# EAGLE design mini_BGM111 (EAGLE 7.4.0)
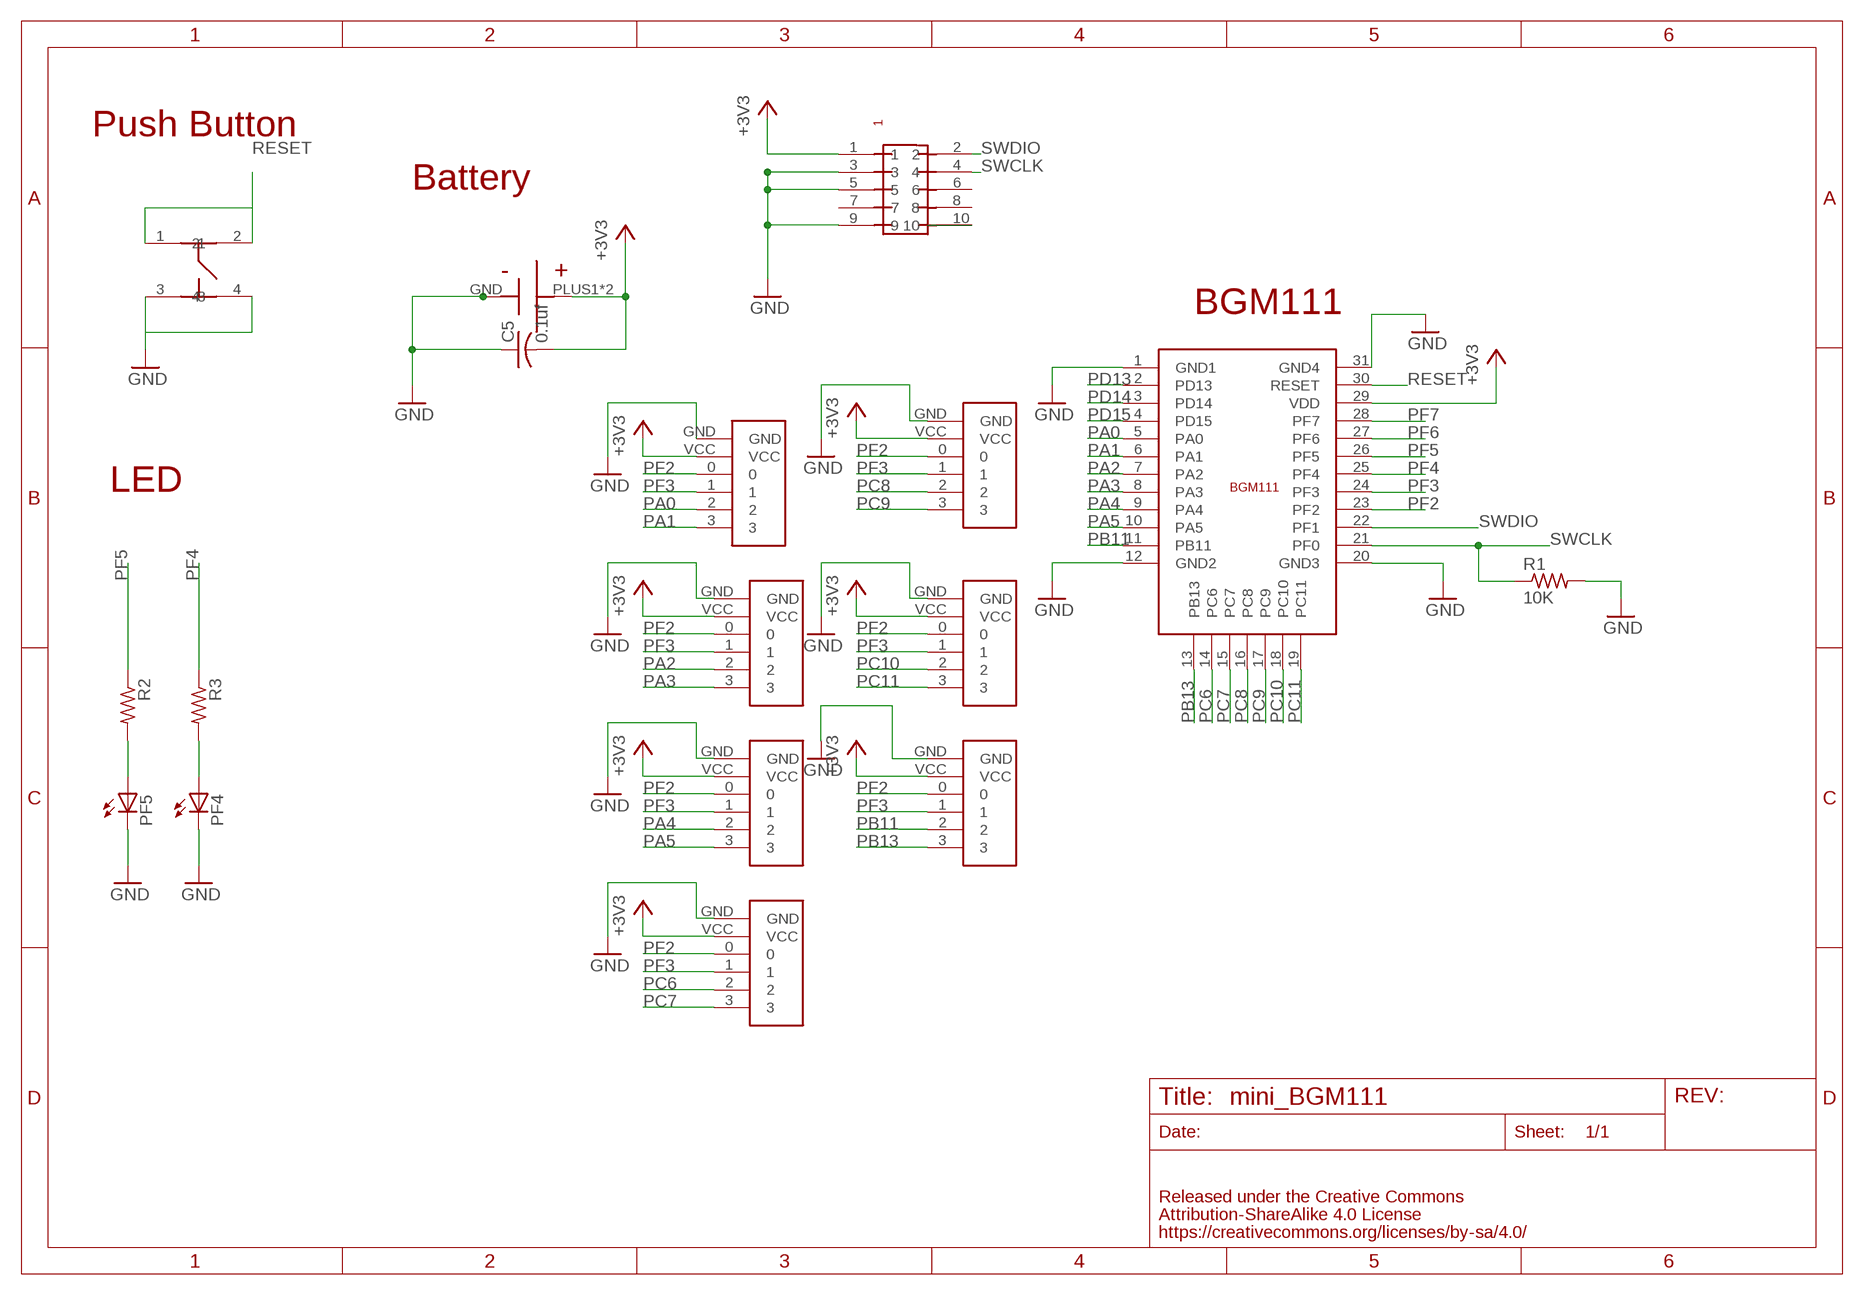
[diagram p0: schematic, sheet 1]

## Parts
C5  0.1uf  C-USC0603  [C0603]
PF4  LEDCHIP-LED0603  [CHIP-LED0603]
PF5  LEDCHIP-LED0603  [CHIP-LED0603]
R1  10K  R-US_R0603  [R0603]
R2  R-US_R0603  [R0603]
R3  R-US_R0603  [R0603]
U$1  SILICONLABS-BGM111  [SILICONLABS-BGM111]
U$2  FABO-PIN-HEADER-2X3-SMD  [FABO-PIN-HEADER-2X3-SMD]
U$3  FABO-PIN-HEADER-2X3-SMD  [FABO-PIN-HEADER-2X3-SMD]
U$4  PIN-HEADER-SMT(1.27MM)2X5  [PIN-HEADER-SMT(1.27MM)2X5]
U$5  SWICTH-4P(KMR2)  [SWITCH-4P(KMR2)]
U$7  FABO-PIN-HEADER-2X3-SMD  [FABO-PIN-HEADER-2X3-SMD]
U$8  FABO-PIN-HEADER-2X3-SMD  [FABO-PIN-HEADER-2X3-SMD]
U$9  FABO-PIN-HEADER-2X3-SMD  [FABO-PIN-HEADER-2X3-SMD]
U$10  FABO-PIN-HEADER-2X3-SMD  [FABO-PIN-HEADER-2X3-SMD]
U$11  FABO-PIN-HEADER-2X3-SMD-BOTTOM  [FABO-PIN-HEADER-2X3-SMD-BOTTOM]
U$12  BRX1-2477  [BRX1-2477]

## Nets
+3V3: C5.2 U$1.29(VDD) U$2.VCC U$3.VCC U$4.1 U$7.VCC U$8.VCC U$9.VCC U$10.VCC U$11.VCC U$12.PLUS1(+) U$12.PLUS2(+)
GND: C5.1 PF4.C PF5.C R1.2 U$1.1(GND1) U$1.12(GND2) U$1.20(GND3) U$1.31(GND4) U$2.GND U$3.GND U$4.3 U$4.5 U$4.9 U$5.3 U$5.4 U$7.GND U$8.GND U$9.GND U$10.GND U$11.GND U$12.GND(-)
N$1: PF5.A R2.2
N$2: PF4.A R3.2
PA0: U$1.5(PA0) U$3.2
PA1: U$1.6(PA1) U$3.3
PA2: U$1.7(PA2) U$7.2
PA3: U$1.8(PA3) U$7.3
PA4: U$1.9(PA4) U$8.2
PA5: U$1.10(PA5) U$8.3
PB11: U$1.11(PB11) U$11.2
PB13: U$1.13(PB13) U$11.3
PC6: U$1.14(PC6) U$2.2
PC7: U$1.15(PC7) U$2.3
PC8: U$1.16(PC8) U$9.2
PC9: U$1.17(PC9) U$9.3
PC10: U$1.18(PC10) U$10.2
PC11: U$1.19(PC11) U$10.3
PD13: U$1.2(PD13)
PD14: U$1.3(PD14)
PD15: U$1.4(PD15)
PF2: U$1.23(PF2) U$2.0 U$3.0 U$7.0 U$8.0 U$9.0 U$10.0 U$11.0
PF3: U$1.24(PF3) U$2.1 U$3.1 U$7.1 U$8.1 U$9.1 U$10.1 U$11.1
PF4: R3.1 U$1.25(PF4)
PF5: R2.1 U$1.26(PF5)
PF6: U$1.27(PF6)
PF7: U$1.28(PF7)
RESET: U$1.30(RESET) U$5.1 U$5.2
RESET1: U$4.10
SWCLK: R1.1 U$1.21(PF0) U$4.4
SWDIO: U$1.22(PF1) U$4.2
Unconnected: U$4.6 U$4.7 U$4.8

## Notes on the sheet
- Push Button
- Battery
- BGM111
- LED

## Library data of the parts
C5 = adafruit:C-US: CAPACITOR, American symbol
PF4 PF5 = led:LED: LED OSRAM: - CHIPLED LG R971, LG N971, LY N971, LG Q971, LY Q971, LO R971, LY R971 LH N974, LH R974 LS Q976, LO Q976, LY Q976 LO Q996 - Hyper CHIPLED LW Q18S LB Q993, LB Q99A, LB R99A - SideLED LS A670, LO A670, LY A670, LG A670, LP A670 LB A673, LV A673, LT A673, LW A673 LH A674 LY A675 LS A676, LA A676, LO A676, LY A676, LW A676 LS A679, LY A679, LG A679 - Hyper Micro SIDELED® LS Y876, LA Y876, LO Y876, LY Y876 LT Y87S - SmartLED LW L88C, LW L88S LB L89C, LB L89S, LG L890 LS L89K, LO L89K, LY L89K LS L896, LA L896, LO L896, LY L896 - TOPLED LS T670, LO T670, LY T670, LG T670, LP T670 LSG T670, LSP T670, LSY T670, LOP T670, LYG T670 LG T671, LOG T671, LSG T671 LB T673, LV T673, LT T673, LW T673 LH T674 LS T676, LA T676, LO T676, LY T676, LB T676, LH T676, LSB T676, LW T676 LB T67C, LV T67C, LT T67C, LS T67K, LO T67K, LY T67K, LW E67C LS E67B, LA E67B, LO E67B, LY E67B, LB E67C, LV E67C, LT E67C LW T67C LS T679, LY T679, LG T679 LS T770, LO T770, LY T770, LG T770, LP T770 LB T773, LV T773, LT T773, LW T773 LH T774 LS E675, LA E675, LY E675, LS T675 LS T776, LA T776, LO T776, LY T776, LB T776 LHGB T686 LT T68C, LB T68C - Hyper Mini TOPLED® LB M676 - Mini TOPLED Santana® LG M470 LS M47K, LO M47K, LY M47K Source: http://www.osram.convergy.de LUXEON: - LUMILED® LXK2-PW12-R00, LXK2-PW12-S00, LXK2-PW14-U00, LXK2-PW14-V00 LXK2-PM12-R00, LXK2-PM12-S00, LXK2-PM14-U00 LXK2-PE12-Q00, LXK2-PE12-R00, LXK2-PE12-S00, LXK2-PE14-T00, LXK2-PE14-U00 LXK2-PB12-K00, LXK2-PB12-L00, LXK2-PB12-M00, LXK2-PB14-N00, LXK2-PB14-P00, LXK2-PB14-Q00 LXK2-PR12-L00, LXK2-PR12-M00, LXK2-PR14-Q00, LXK2-PR14-R00 LXK2-PD12-Q00, LXK2-PD12-R00, LXK2-PD12-S00 LXK2-PH12-R00, LXK2-PH12-S00 LXK2-PL12-P00, LXK2-PL12-Q00, LXK2-PL12-R00 Source: www.luxeon.com KINGBRIGHT: KA-3528ASYC Source: www.kingbright.com
R1-R3 = adafruit:R-US_: RESISTOR, American symbol
U$1 = FaBo-BT:SILICONLABS-BGM111
U$2 U$3 U$7-U$10 = FaBo-PIN:FABO-PIN-HEADER-2X3-SMD
U$4 = gclue:PIN-HEADER-SMT(1.27MM)2X5: PIN-HEADER-SMT (1.27MM) 2x5
U$5 = gclue-test:SWICTH-4P(KMR2)
U$11 = FaBo-PIN:FABO-PIN-HEADER-2X3-SMD-BOTTOM
U$12 = FaBo-Supply:BRX1-2477

## Board
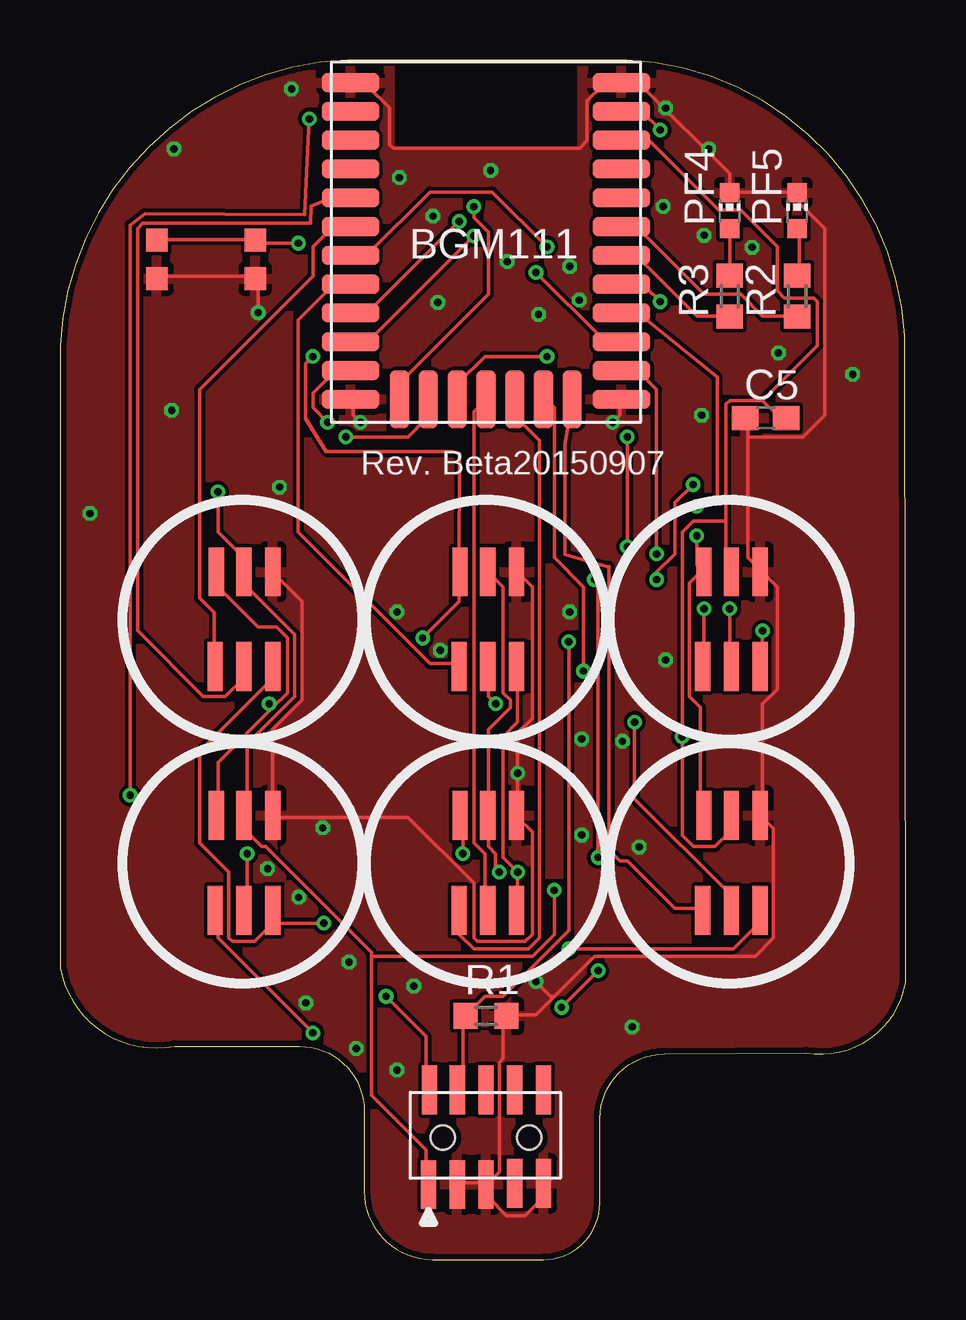
[diagram p1: board, top side]
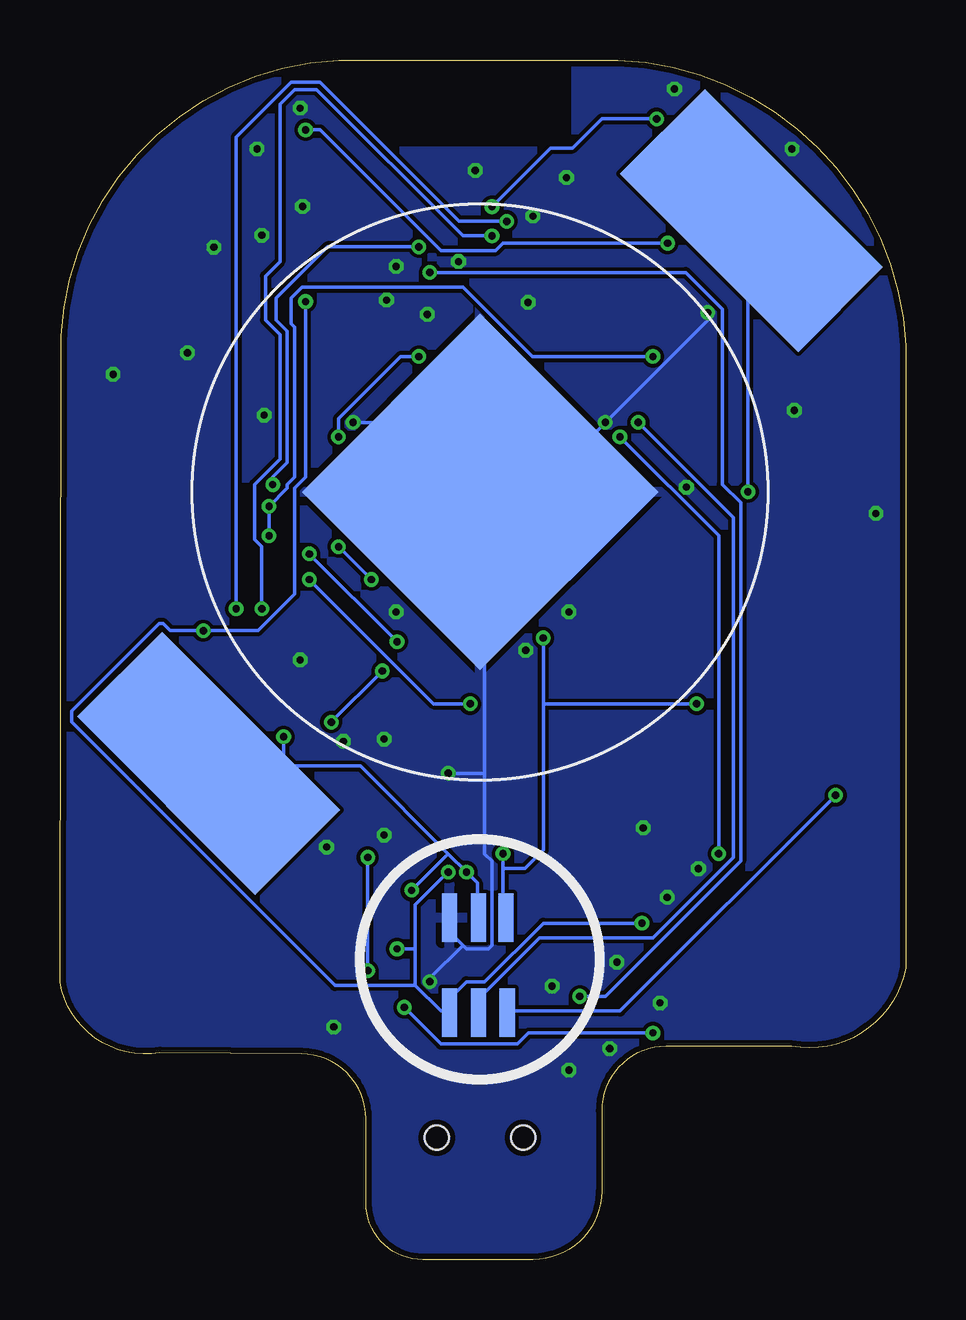
[diagram p2: board, bottom side, seen from below]

Size 35.26 x 50 mm. Coordinates in mm from the lower left corner, seen from the top.
Outline: 4.78,8.89 10,8.89 arc-90 12.68,6.21 12.68,2.86 arc90 15.54,0 20.15,0 arc90 22.51,2.36 22.51,5.87 arc-90 25.2,8.58 31.1,8.62 arc90 35.26,11.56 35.21,38.51 arc90 22.45,50 13.16,50 arc90 0,38.09 0,12.17 arc90 4.78,8.89
Copper layers (1*16): Top 0.035mm / dielectric 1.5mm / Bottom 0.035mm
Design rules "SeeedStudio_2layer_DRU_no_angle_20140221": minimum track width 6mil, minimum drill 12mil, track to track 6mil, track to pad 6mil, pad to pad 6mil, via to via 6mil, smd to smd 0mil, copper to edge 10mil, drill to drill 10mil, minimum pad ring 10mil, minimum via ring 6mil, stop-mask expansion 2mil, vias tented up to drill 100mil, thermal gap 10mil

### Footprints (pad centres in the part's own frame; a part is rotated, then mirrored left to right if it is on the bottom)
C0603 = smd 1.1 x 1: 1 -0.85,0; 2 0.85,0
CHIP-LED0603 = smd 0.8 x 0.8: A 0,-0.75; C 0,0.75
R0603 = smd 1 x 1.1: 1 -0.85,0; 2 0.85,0
SILICONLABS-BGM111 = smd 2.4 x 0.8: 1 -5.65,6.65; 2 -5.65,5.45; 3 -5.65,4.25; 4 -5.65,3.05; 5 -5.65,1.85; 6 -5.65,0.65; 7 -5.65,-0.55; 8 -5.65,-1.75; 9 -5.65,-2.95; 10 -5.65,-4.15; 11 -5.65,-5.35; 12 -5.65,-6.55; 20 5.65,-6.55; 21 5.65,-5.35; 22 5.65,-4.15; 23 5.65,-2.95; 24 5.65,-1.75; 25 5.65,-0.55; 26 5.65,0.65; 27 5.65,1.85; 28 5.65,3.05; 29 5.65,4.25; 30 5.65,5.45; 31 5.65,6.65 | smd 0.8 x 2.4: 13 -3.6,-6.55; 14 -2.4,-6.55; 15 -1.2,-6.55; 16 0,-6.55; 17 1.2,-6.55; 18 2.4,-6.55; 19 3.6,-6.55
FABO-PIN-HEADER-2X3-SMD = smd 0.635 x 2.032: 0 -1.08,2; 1 1.27,-1.95; 2 0.07,-1.95; 3 -1.13,-1.95; GND 1.27,2; VCC 0.07,2
PIN-HEADER-SMT(1.27MM)2X5 = smd 0.635 x 2.032: 1 -2.4,-1.95; 2 -2.35,2; 3 -1.2,-1.95; 4 -1.2,2; 5 0,-1.95; 6 0,2; 7 1.2,-1.9; 8 1.2,2; 9 2.4,-1.9; 10 2.4,2 | hole 1: 1.8,0; -1.8,0
SWITCH-4P(KMR2) = smd 0.9 x 0.95: 1 -1,0; 2 3.1,0; 3 -1,-1.6; 4 3.1,-1.6
FABO-PIN-HEADER-2X3-SMD-BOTTOM = smd 0.635 x 2.032 bottom: 0 -1.08,2; 1 1.27,-1.95; 2 0.07,-1.95; 3 -1.13,-1.95; GND 1.27,2; VCC 0.07,2
BRX1-2477 = smd 10.5 x 10.5 bottom: GND 0,0 | smd 5 x 10.5 bottom: PLUS1 -16,0; PLUS2 16,0

### Placement (x,y rotation side)
C5  29.42,35.08 0 top
PF4  27.92,43.72 0 top
PF5  30.73,43.72 0 top
R1  17.76,10.16 0 top
R2  30.73,40.16 90 top
R3  27.92,40.16 90 top
U$1  17.76,42.41 0 top
U$2  7.6,16.51 0 top
U$3  7.6,26.67 0 top
U$4  17.76,5.08 0 top
U$5  5.04,42.49 0 top
U$7  17.76,26.67 0 top
U$8  27.92,26.67 0 top
U$9  17.76,16.51 0 top
U$10  27.92,16.51 0 top
U$11  17.75,12.25 0 top
U$12  17.75,32 135 top

### Tracks (layer width: path | path; a pad name or v marks a point on that pad's centre or on a via)
+3V3  (via drill 0.3)
  Top 0.152: U$7.VCC 17.86,28.65 18.47,28.04 18.47,23.62 18.78,23.32 18.78,23.01 17.86,22.1 17.86,18.59 U$9.VCC 17.86,18.44 17.86,17.22 18.17,16.92 18.17,16.31 v18.32,16.15 | 29.29,35.81 29.9,35.2 30.21,35.2 C5.2 | 29.29,35.81 27.92,35.81 27.77,35.66 27.77,30.79 | 27.77,30.79 27.77,28.96 27.92,28.8 U$8.VCC | 27.77,30.79 26.4,30.79 25.94,30.33 v25.94,21.79 25.94,17.68 26.4,17.22 27.31,17.22 27.92,17.83 27.92,18.44 U$10.VCC | 29.29,35.81 31.58,38.1 31.58,39.93 31.43,40.08 30.21,40.08 29.9,40.39 29.9,42.22 28.38,43.74 27.46,43.74 24.57,46.63 23.5,46.63 U$1.29 | 12.98,12.65 12.98,12.8 8.57,17.22 8.41,17.22 7.8,17.83 7.8,18.44 U$2.VCC 7.8,18.59 7.8,21.49 9.78,23.47 9.78,26.06 7.8,28.04 7.8,28.65 U$3.VCC 7.65,28.8 7.65,29.26 6.58,30.33 v6.58,32 | 12.98,12.65 12.98,6.86 15.27,4.57 15.27,3.2 U$4.1 | v20.61,15.39 20.61,13.56 19.69,12.65 12.98,12.65
  Bottom 0.152: 19.08,16.92 22.74,20.57 25.94,20.57 | 19.08,16.92 v18.32,16.15 17.86,15.7 17.86,14.33 U$11.VCC | 25.94,20.57 28.99,20.57 U$12.PLUS1 25.94,20.57 | v25.94,21.79 25.94,20.57 | v6.58,32 6.58,43.28 U$12.PLUS2 | v20.61,15.39 19.08,16.92
GND  (via drill 0.3)
  Top 0.152: U$3.GND 8.87,28.65 10.09,27.43 10.09,23.32 8.87,22.1 U$2.GND 8.87,18.44 14.51,18.44 17.25,15.7 17.25,13.41 17.4,13.26 19.39,13.26 19.69,13.56 19.69,17.83 19.08,18.44 U$9.GND 19.08,18.59 v19.08,20.27 19.08,21.95 19.69,22.55 19.69,28.04 19.08,28.65 U$7.GND | U$5.3 4.15,41 8.11,41 U$5.4 8.26,40.84 v8.26,39.47 | v12.53,34.9 12.22,35.2 12.22,35.81 U$1.12 | v23.04,34.9 23.35,35.2 23.35,35.81 U$1.20 | 27.92,44.5 30.66,44.5 PF5.C 30.82,44.35 30.82,44.04 31.88,42.98 31.88,35.2 30.97,34.29 28.68,34.29 | 27.92,44.5 27.92,45.26 24.26,48.92 23.5,48.92 U$1.31 23.35,48.92 22.59,48.92 21.98,48.31 21.98,46.63 21.67,46.33 13.9,46.33 13.75,46.48 13.75,48.01 12.83,48.92 12.22,48.92 U$1.1 | 27.92,44.5 PF4.C | U$4.5 17.86,3.2 18.32,3.66 18.32,8.23 18.47,8.38 18.47,10.06 R1.2 18.62,10.21 19.84,10.21 20.61,10.97 | U$4.3 16.64,3.2 17.71,3.2 U$4.5 | U$4.9 20.15,3.05 20.15,2.59 19.39,1.83 18.62,1.83 17.86,2.59 17.86,3.05 U$4.5 | 28.68,34.29 28.68,29.26 29.14,28.8 U$8.GND 29.29,28.65 29.9,28.04 29.9,23.77 29.29,23.16 29.29,18.59 U$10.GND 29.29,18.44 29.75,17.98 29.75,13.41 28.99,12.65 22.28,12.65 20.61,10.97 | 28.68,34.29 28.68,35.05 C5.1 | v19.84,11.58 20.45,10.97 20.61,10.97
  Bottom 0.152: 18.47,13.11 18.32,12.95 17.4,12.95 17.25,13.11 17.25,16.61 17.56,16.92 17.56,20.27 | 18.47,13.11 18.93,13.56 18.93,14.17 U$11.GND | 17.56,31.7 17.56,20.27 | 17.56,31.7 17.71,31.85 U$12.GND | v8.26,39.47 8.26,39.17 v12.53,34.9 15.73,31.7 17.56,31.7 | 17.56,31.7 U$12.GND | v23.04,34.9 20.76,34.9 17.86,32 U$12.GND | 17.56,20.27 v19.08,20.27 | 18.47,13.11 19.84,11.73 v19.84,11.58
  other vias: 25.25,25 21.25,27 21.65,40 19.95,39.4 15.75,39.9 4.65,35.4 1.25,31.1 33.05,36.9 29.95,37.8 14.05,27 10.25,10.7 23.45,21.6 24.15,17.2 21.75,21.7 21.75,17.7 15.85,25.4 27.05,46.3 26.85,42.7 25.15,43.9 14.15,45.1 15.55,43.5 17.95,45.4 26.75,35.2 12.05,12.4 14.75,11.4 12.35,8.8 14.05,7.9 23.85,9.7 10.95,18 9.95,15.1 8.65,16.3 21.25,41.4 18.65,41.6 28.85,42.2 4.75,46.3 9.15,32.2 9.65,48.8 25.25,48
  pour Bottom: -2.75,-3 40.25,-3 40.25,52 -2.75,52
  pour Top: -2.75,-3 40.25,-3 40.25,52 -2.75,52
N$1
  Top 0.152: PF5.A 30.82,42.82 30.82,41.15 R2.2
N$2
  Top 0.152: R3.2 PF4.A
PA0
  Top 0.152: U$3.2 7.65,24.69 7.65,24.23 6.89,23.47 5.97,23.47 3.23,26.21 3.23,42.98 3.45,43.2 10.45,43.2 10.47,43.92 11.17,44.2 U$1.5
PA1
  Top 0.152: U$3.3 6.43,24.84 6.43,26.98 5.82,27.58 5.82,36.27 10.55,41 10.55,42.22 11.31,42.98 12.07,42.98 U$1.6
PA2  (via drill 0.3)
  Top 0.152: v18.17,23.16 17.86,23.47 17.86,24.69 U$7.2 | v24.87,28.35 24.87,28.65 25.63,29.41 25.63,31.55 v26.4,32.31 | v20.3,42.22 18.01,44.5 15.42,44.5 12.83,41.91 12.22,41.91 U$1.7
  Bottom 0.152: v18.17,23.16 19.69,23.16 v24.87,28.35 | v26.4,32.31 26.4,32.61 25.79,33.22 25.79,38.71 26.24,39.17 26.24,40.08 24.11,42.22 v20.3,42.22
PA3
  Top 0.152: U$7.3 16.49,24.84 15.42,24.84 9.94,30.33 9.94,39.17 11.31,40.54 12.07,40.54 U$1.8
PA4  (via drill 0.3)
  Top 0.152: v27.92,27.13 27.92,24.84 U$8.2 | v16.64,43.28 12.83,39.47 12.22,39.47 U$1.9
  Bottom 0.152: v27.92,27.13 27.92,46.79 25.63,49.07 24.41,49.07 18.62,43.28 v16.64,43.28
PA5  (via drill 0.3)
  Top 0.152: v26.85,27.13 26.85,24.84 U$8.3 | v17.25,42.67 12.98,38.41 12.22,38.41 U$1.10
  Bottom 0.152: v26.85,27.13 26.85,29.72 27.16,30.02 27.16,32.31 26.09,33.38 26.09,38.56 26.7,39.17 26.7,41 26.09,41.6 26.09,48.16 25.48,48.77 24.57,48.77 18.47,42.67 v17.25,42.67
PB11  (via drill 0.3)
  Top 0.152: v11.16,34.9 10.55,35.51 10.55,36.12 11.46,37.03 12.07,37.03 U$1.11
  Bottom 0.152: v11.16,34.9 7.19,30.94 7.19,16.76 10.55,13.41 15.27,13.41 17.71,10.97 17.71,10.36 U$11.2
PB13  (via drill 0.3)
  Top 0.152: v2.93,19.36 2.93,43.13 3.55,43.6 10.2,43.55 v10.39,47.55 | v17.25,43.89 17.25,43.43 17.86,42.82 17.86,40.23 14.2,36.58 14.2,35.97 U$1.13
  Bottom 0.152: v2.93,19.36 11.92,10.36 16.49,10.36 U$11.3 | v10.39,47.55 12.68,47.55 13.9,46.33 14.81,46.33 v17.25,43.89
PC6  (via drill 0.3)
  Top 0.152: v7.8,16.92 7.8,14.63 U$2.2 | v11.92,34.29 14.51,34.29 15.27,35.05 15.27,35.81 U$1.14
  Bottom 0.152: v7.8,16.92 7.8,30.18 v11.92,34.29
PC7  (via drill 0.3)
  Top 0.152: v10.55,9.45 6.58,13.41 6.58,14.48 U$2.3 | v22.43,12.04 v20.91,10.52 | v22.43,16.76 22.43,28.19 v22.28,28.35 | v23.65,34.29 v23.65,29.72 | v20.3,37.64 17.71,37.64 16.64,36.58 16.64,35.97 U$1.15
  Bottom 0.152: v10.55,9.45 15.73,9.45 16.19,8.99 19.39,8.99 v20.91,10.52 | v22.43,16.76 v22.43,12.04 | v23.65,29.72 v22.28,28.35 | v23.65,34.29 23.65,35.05 21.06,37.64 v20.3,37.64
PC8
  Top 0.152: U$9.2 17.71,14.63 17.71,16.92 17.25,17.37 17.25,35.36 17.71,35.81 U$1.16
PC9
  Top 0.152: U$9.3 16.64,14.48 16.64,13.56 17.25,12.95 19.54,12.95 20,13.41 20,34.14 19.08,35.05 19.08,35.81 U$1.17
PC10  (via drill 0.3)
  Top 0.152: v23.96,22.4 23.96,19.2 27.92,15.24 27.92,14.63 U$10.2 | v21.82,24.54 21.82,28.04 20.61,29.26 20.61,35.51 20.3,35.81 U$1.18
  Bottom 0.152: v21.82,24.54 v23.96,22.4
PC11
  Top 0.152: U$10.3 26.7,14.63 25.63,14.63 23.65,16.61 23.35,16.61 22.89,17.07 22.89,28.89 22.8,28.9 21.05,29.4 21.05,34 21.37,35.81 U$1.19
PF2  (via drill 0.3)
  Top 0.152: 8.87,23.01 9.48,23.62 9.48,25.91 9.02,26.36 8.26,26.36 6.58,28.04 6.58,28.65 U$3.0 | 8.87,23.01 6.58,20.73 6.58,18.59 U$2.0 | v16.8,16.92 16.8,18.44 U$9.0 | v15.12,25.91 16.64,27.43 16.64,28.65 U$7.0 16.64,28.8 16.65,33.6 16.36,33.69 11.1,33.69 10.24,35.05 10.24,37.34 v10.55,37.64 | v8.72,23.16 8.87,23.01 | U$10.0 26.7,18.59 26.7,23.01 26.24,23.47 26.24,28.19 26.7,28.65 U$8.0 26.7,28.8 26.55,28.96 v26.55,30.18 | v26.55,31.39 27.41,31.85 27.41,36.78 24.26,39.32 23.5,39.32 U$1.23
  Bottom 0.152: v16.8,16.92 16.8,16.31 | 16.8,16.31 16.8,14.33 U$11.0 | 15.12,23.16 15.12,17.07 15.88,16.31 16.8,16.31 | 15.12,23.16 v15.12,25.91 | 15.12,23.16 v8.72,23.16 | v26.55,30.18 v26.55,31.39 25.79,32.16 25.79,32.31 25.48,32.61 25.48,38.86 25.63,39.01 25.63,40.08 25.18,40.54 18.47,40.54 15.58,37.64 v10.55,37.64
PF3  (via drill 0.3)
  Top 0.152: 8.87,14.02 U$2.1 8.87,14.48 | 8.87,14.02 8.11,13.26 7.19,13.26 7.04,13.41 7.04,16.15 5.82,17.37 5.82,21.18 8.87,24.23 U$3.1 | U$9.1 19.08,14.63 v19.08,16.15 18.47,16.76 18.47,21.79 19.08,22.4 19.08,24.69 U$7.1 | v21.21,12.95 28.07,12.95 29.14,14.02 29.14,14.48 U$10.1 | v29.29,26.21 29.29,24.84 U$8.1 | v25.02,39.93 24.41,40.54 23.5,40.54 U$1.24 | v11,14.02 8.87,14.02
  Bottom 0.152: 20.45,11.43 19.39,10.36 19.08,10.36 U$11.1 18.93,10.36 18.93,10.97 18.32,11.58 17.56,11.58 15.12,14.02 v11,14.02 | 20.45,12.95 20.45,14.78 v19.08,16.15 | 20.45,12.95 20.45,11.43 | 20.45,12.95 v21.21,12.95 | 20.45,11.43 23.8,11.43 34.78,22.4 34.78,22.86 31.12,26.52 30.97,26.52 30.66,26.21 v29.29,26.21 27.01,26.21 25.48,27.74 25.48,32.16 25.02,32.61 v25.02,39.93
PF4
  Top 0.152: R3.1 26.55,39.32 24.11,41.76 23.5,41.76 U$1.25
PF5
  Top 0.152: R2.1 30.66,39.32 29.29,39.32 28.38,40.23 26.85,40.23 24.11,42.98 23.5,42.98 U$1.26
RESET  (via drill 0.3)
  Top 0.152: U$5.1 4.15,42.52 8.11,42.52 U$5.2 8.26,42.37 v9.94,42.37 | v25.02,47.09 24.26,47.85 23.5,47.85 U$1.30
  Bottom 0.152: v9.94,42.37 16.8,42.37 17.1,42.06 19.39,42.06 24.41,47.09 v25.02,47.09
SWCLK  (via drill 0.3)
  Top 0.152: U$4.4 16.64,7.16 16.8,7.32 16.8,10.06 R1.1 16.95,10.21 17.71,10.97 18.47,10.97 21.21,13.72 v21.21,25.76 | v24.87,29.41 24.87,36.27 24.11,37.03 23.5,37.03 U$1.21
  Bottom 0.152: v21.21,25.76 v24.87,29.41
SWDIO  (via drill 0.3)
  Top 0.152: v13.59,10.97 15.27,9.3 15.27,7.16 U$4.2 | v19.84,41.15 22.59,38.41 23.35,38.41 U$1.22
  Bottom 0.152: v13.59,10.97 12.53,10.97 6.89,16.61 6.89,31.55 7.65,32.31 7.65,39.62 9.18,41.15 v19.84,41.15

### Text on the board
tPlace: Rev. Beta20150907